# Altium schematic sheet ruler.SchDoc
size C
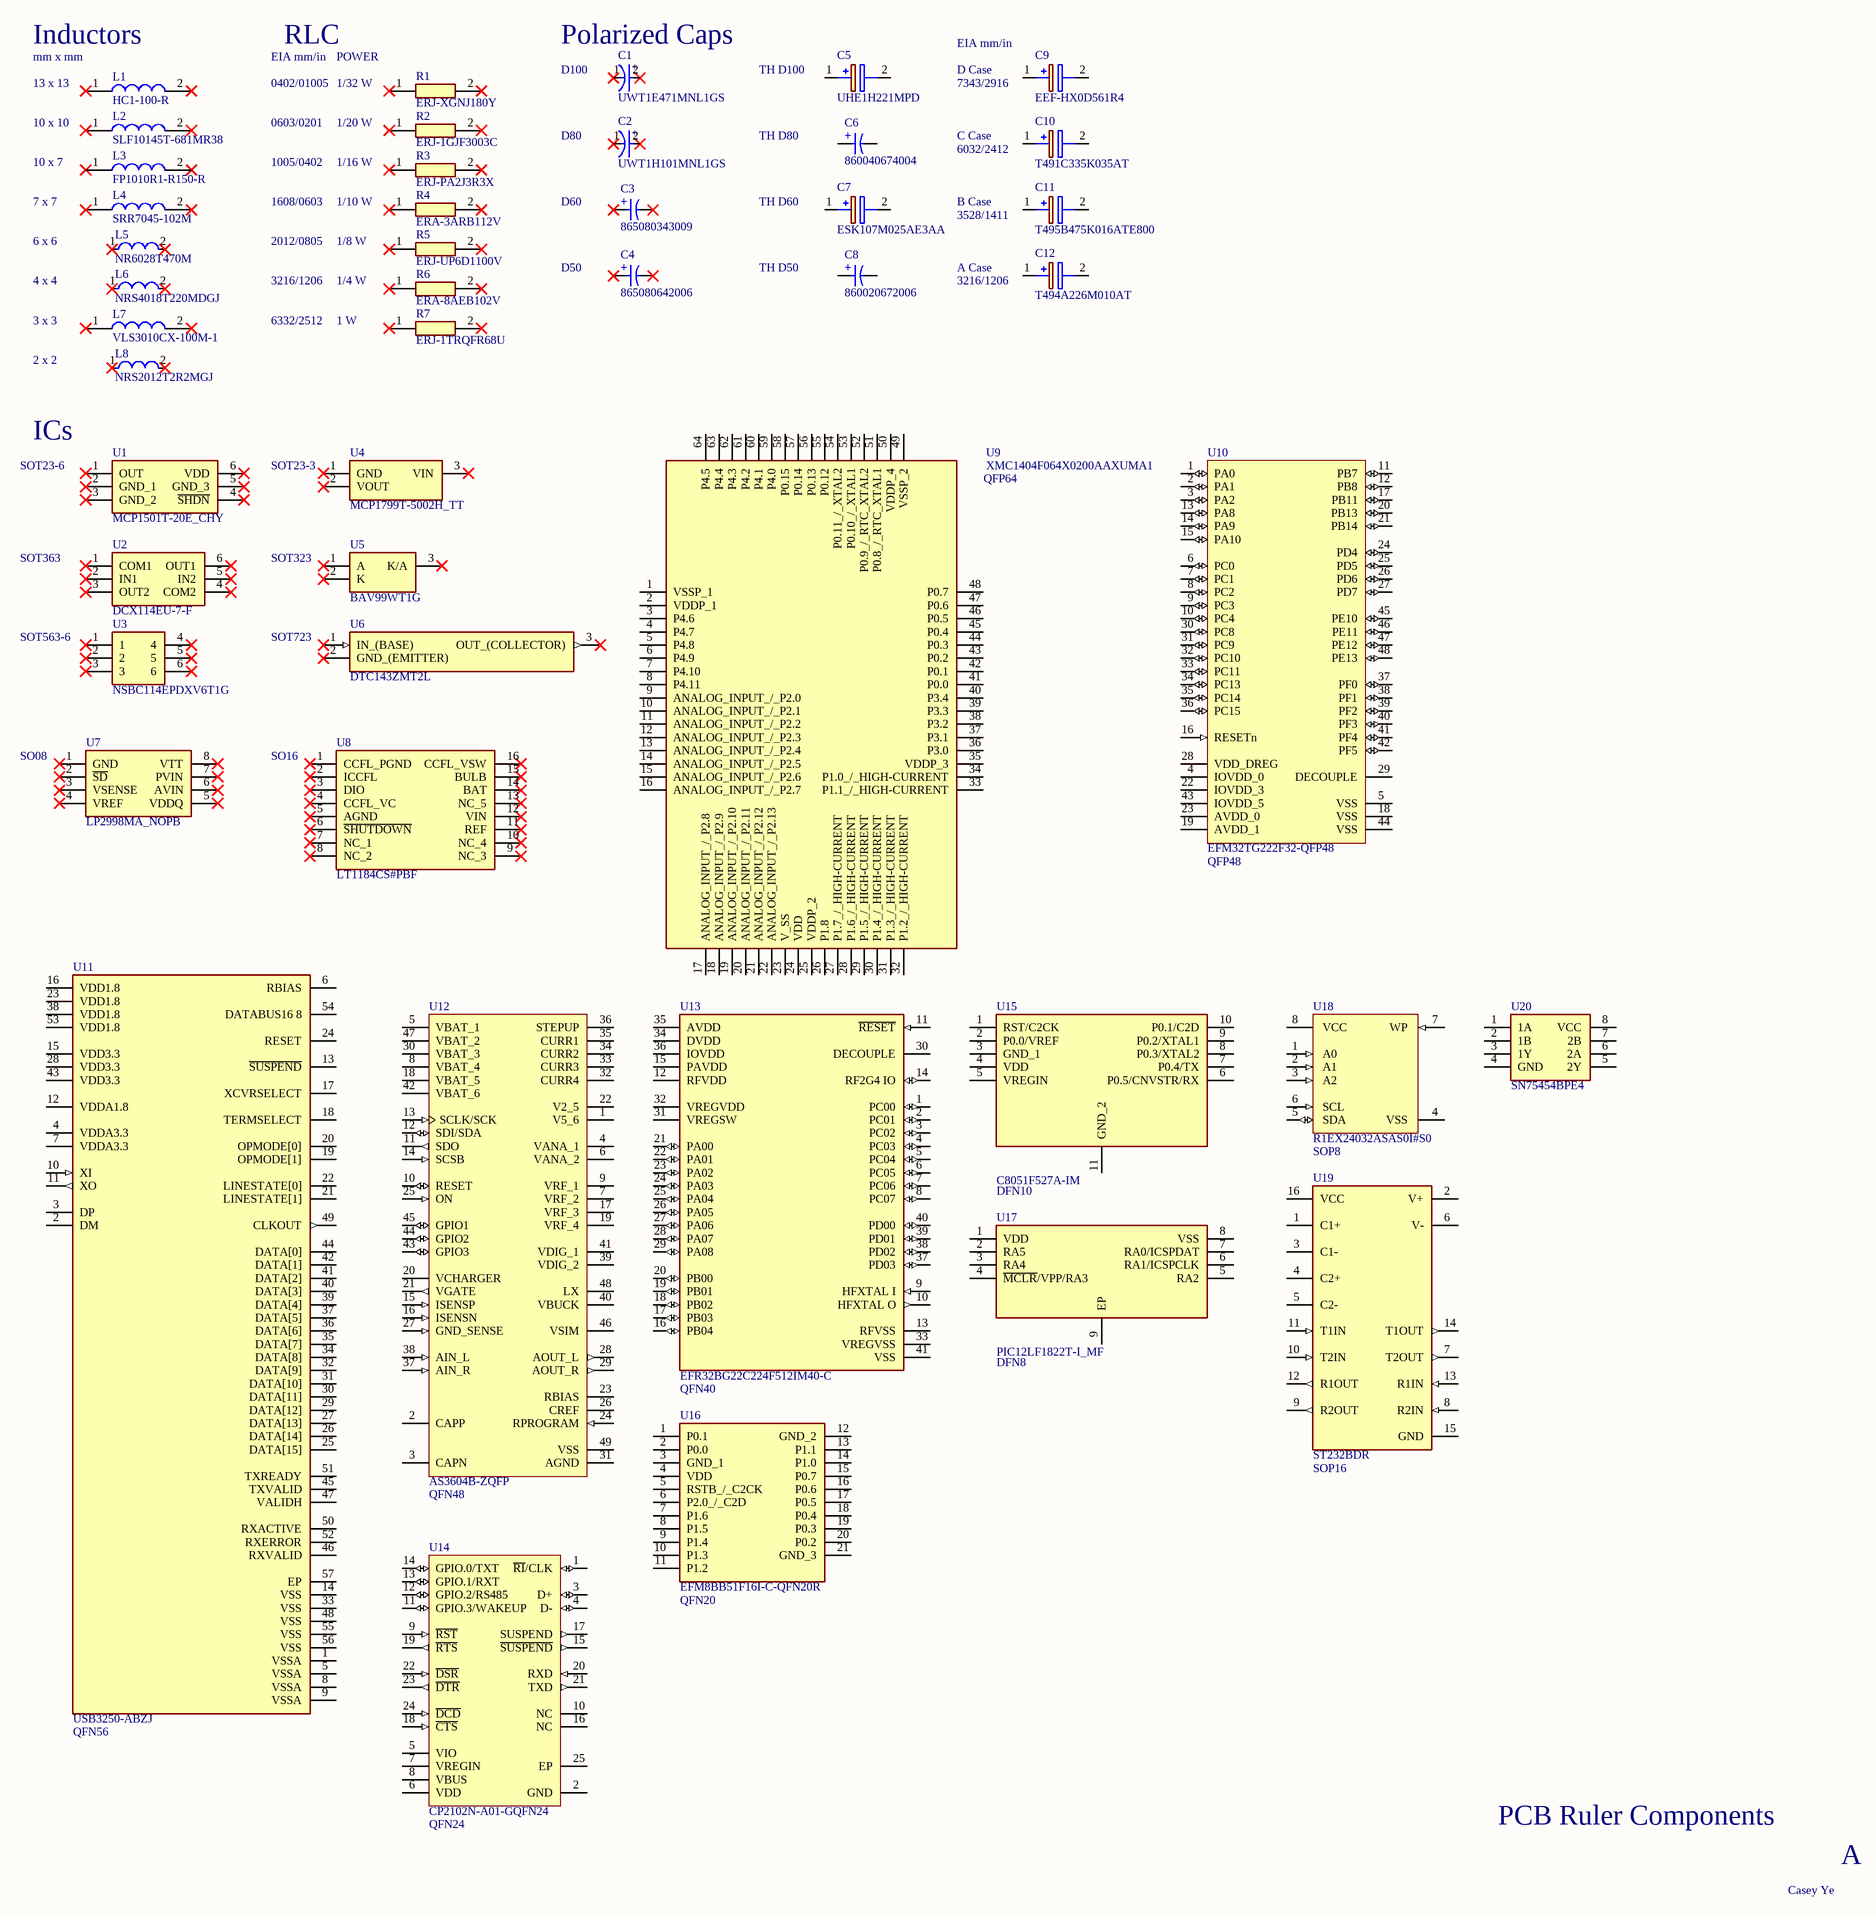
[diagram p0: ruler.SchDoc]

## Parts
C1  UWT1E471MNL1GS  [FP-UWT1E471MNL1GS-MFG]
C2  UWT1H101MNL1GS  [FP-UWT1H101MNL1GS-MFG]
C3  865080343009  [WCAP-ASLI_D6.3H5.5]
C4  865080642006  [WCAP-ASLI_D5H5.5]
C5  UHE1H221MPD  [CAPPRD500W60D1025H1750]
C6  860040674004  [WCAP-ATUL_D8H11.5]
C7  ESK107M025AE3AA  [CAPPRD250W50D630H1250]
C8  860020672006  [WCAP-ATG5_D5H11]
C9  EEF-HX0D561R4  [HX_Series]
C10  T491C335K035AT  [T491C]
C11  T495B475K016ATE800  [T495B]
C12  T494A226M010AT  [T494A]
L1  HC1-100-R  [HC1100R]
L2  SLF10145T-681MR38  [SLF10145]
L3  FP1010R1-R150-R  [FP1010R1R150R]
L4  SRR7045-102M  [SRR7045102M]
L5  NR6028T470M  [FP-NR6028-MFG]
L6  NRS4018T220MDGJ  [FP-NR4018-MFG]
L7  VLS3010CX-100M-1  [VLS3010]
L8  NRS2012T2R2MGJ  [FP-NRS2012-MFG]
R1  ERJ-XGNJ180Y  [ERJXG_(01005)]
R2  ERJ-1GJF3003C  [ERJ1GJJ2R4C]
R3  ERJ-PA2J3R3X  [RESC1005X40N]
R4  ERA-3ARB112V  [ERA3AEB101V]
R5  ERJ-UP6D1100V  [ERJUP6]
R6  ERA-8AEB102V  [RESC3216X70N]
R7  ERJ-1TRQFR68U  [ER1TR_(2512)]
U1  MCP1501T-20E_CHY  [SOT95P280X145-6N]
U2  DCX114EU-7-F  [SOT65P210X110-6N]
U3  NSBC114EPDXV6T1G  [SOTFL50P160X60-6N]
U4  MCP1799T-5002H_TT  [SOT95P237X112-3N]
U5  BAV99WT1G  [SOT65P220X100-3N]
U6  DTC143ZMT2L  [SOT40P120X55-3N]
U7  LP2998MA_NOPB  [SOIC127P600X175-8N]
U8  LT1184CS#PBF  [SOIC127P599X175-16N]
U9  XMC1404F064X0200AAXUMA1  [QFP50P1200X1200X160-64N]
U10  EFM32TG222F32-QFP48  [ENMR-TQFP48_M]
U11  USB3250-ABZJ  [FP-56QFN-4304-8x8B-MFG]
U12  AS3604B-ZQFP  [AMS-QFN-48-6000X6000DE-4300X4300TP_L]
U13  EFR32BG22C224F512IM40-C  [FP-EFR32BG22C224F512IM40-MFG]
U14  CP2102N-A01-GQFN24  [SLAB-QFN-24-2550x2550TP_A_V]
U15  C8051F527A-IM  [SON50P300X300X100-11N-D]
U16  EFM8BB51F16I-C-QFN20R  [EFM8BB51F16ICQFN20R]
U17  PIC12LF1822T-I_MF  [SON65P300X300X100-9N-D]
U18  R1EX24032ASAS0I#S0  [SOP127P600X173-8_PRSP0008DF-B_N]
U19  ST232BDR  [FP-SO-16-0016020D-IPC_C]
U20  SN75454BPE4  [DIP794W53P254L959H508Q8N]

## Nets

Not connected (* = marked no-connect by the designer): C1 1(C)* 2(A)*; C2 1(C)* 2(A)*; C3 1(P)* 2(N)*; C4 1(P)* 2(N)*; C5 1(+) 2(-); C6 1(P) 2(N); C7 1(+) 2(-); C8 1(P) 2(N); C9 1(+) 2(-); C10 1(+) 2(-); C11 1(+) 2(-); C12 1(+) 2(-); L1 1* 2*; L2 1* 2*; L3 1* 2*; L4 1* 2*; L5 1* 2*; L6 1* 2*; L7 1* 2*; L8 1* 2*; R1 1* 2*; R2 1* 2*; R3 1* 2*; R4 1* 2*; R5 1* 2*; R6 1* 2*; R7 1* 2*; U1 1(OUT)* 2(GND_1)* 3(GND_2)* 4(~{SHDN})* 5(GND_3)* 6(VDD)*; U2 1(COM1)* 2(IN1)* 3(OUT2)* 4(COM2)* 5(IN2)* 6(OUT1)*; U3 1* 2* 3* 4* 5* 6*; U4 1(GND)* 2(VOUT)* 3(VIN)*; U5 1(A)* 2(K)* 3(K/A)*; U6 1(IN_(BASE))* 2(GND_(EMITTER))* 3(OUT_(COLLECTOR))*; U7 1(GND)* 2(~{SD})* 3(VSENSE)* 4(VREF)* 5(VDDQ)* 6(AVIN)* 7(PVIN)* 8(VTT)*; U8 1(CCFL_PGND)* 2(ICCFL)* 3(DIO)* 4(CCFL_VC)* 5(AGND)* 6(~{SHUTDOWN})* 7(NC_1)* 8(NC_2)* 9(NC_3)* 10(NC_4)* 11(REF)* 12(VIN)* 13(NC_5)* 14(BAT)* 15(BULB)* 16(CCFL_VSW)*; U9 1(VSSP_1) 2(VDDP_1) 3(P4.6) 4(P4.7) 5(P4.8) 6(P4.9) 7(P4.10) 8(P4.11) 9(ANALOG_INPUT_/_P2.0) 10(ANALOG_INPUT_/_P2.1) 11(ANALOG_INPUT_/_P2.2) 12(ANALOG_INPUT_/_P2.3) 13(ANALOG_INPUT_/_P2.4) 14(ANALOG_INPUT_/_P2.5) 15(ANALOG_INPUT_/_P2.6) 16(ANALOG_INPUT_/_P2.7) 17(ANALOG_INPUT_/_P2.8) 18(ANALOG_INPUT_/_P2.9) 19(ANALOG_INPUT_/_P2.10) 20(ANALOG_INPUT_/_P2.11) 21(ANALOG_INPUT_/_P2.12) 22(ANALOG_INPUT_/_P2.13) 23(V_SS) 24(VDD) 25(VDDP_2) 26(P1.8) 27(P1.7_/_HIGH-CURRENT) 28(P1.6_/_HIGH-CURRENT) 29(P1.5_/_HIGH-CURRENT) 30(P1.4_/_HIGH-CURRENT) 31(P1.3_/_HIGH-CURRENT) 32(P1.2_/_HIGH-CURRENT) 33(P1.1_/_HIGH-CURRENT) 34(P1.0_/_HIGH-CURRENT) 35(VDDP_3) 36(P3.0) 37(P3.1) 38(P3.2) 39(P3.3) 40(P3.4) 41(P0.0) 42(P0.1) 43(P0.2) 44(P0.3) 45(P0.4) 46(P0.5) 47(P0.6) 48(P0.7) 49(VSSP_2) 50(VDDP_4) 51(P0.8_/_RTC_XTAL1) 52(P0.9_/_RTC_XTAL2) 53(P0.10_/_XTAL1) 54(P0.11_/_XTAL2) 55(P0.12) 56(P0.13) 57(P0.14) 58(P0.15) 59(P4.0) 60(P4.1) 61(P4.2) 62(P4.3) 63(P4.4) 64(P4.5); U10 1(PA0) 2(PA1) 3(PA2) 4(IOVDD_0) 5(VSS) 6(PC0) 7(PC1) 8(PC2) 9(PC3) 10(PC4) 11(PB7) 12(PB8) 13(PA8) 14(PA9) 15(PA10) 16(RESETn) 17(PB11) 18(VSS) 19(AVDD_1) 20(PB13) 21(PB14) 22(IOVDD_3) 23(AVDD_0) 24(PD4) 25(PD5) 26(PD6) 27(PD7) 28(VDD_DREG) 29(DECOUPLE) 30(PC8) 31(PC9) 32(PC10) 33(PC11) 34(PC13) 35(PC14) 36(PC15) 37(PF0) 38(PF1) 39(PF2) 40(PF3) 41(PF4) 42(PF5) 43(IOVDD_5) 44(VSS) 45(PE10) 46(PE11) 47(PE12) 48(PE13); U11 1(VSSA) 2(DM) 3(DP) 4(VDDA3.3) 5(VSSA) 6(RBIAS) 7(VDDA3.3) 8(VSSA) 9(VSSA) 10(XI) 11(XO) 12(VDDA1.8) 13(~{SUSPEND}) 14(VSS) 15(VDD3.3) 16(VDD1.8) 17(XCVRSELECT) 18(TERMSELECT) 19(OPMODE[1]) 20(OPMODE[0]) 21(LINESTATE[1]) 22(LINESTATE[0]) 23(VDD1.8) 24(RESET) 25(DATA[15]) 26(DATA[14]) 27(DATA[13]) 28(VDD3.3) 29(DATA[12]) 30(DATA[11]) 31(DATA[10]) 32(DATA[9]) 33(VSS) 34(DATA[8]) 35(DATA[7]) 36(DATA[6]) 37(DATA[5]) 38(VDD1.8) 39(DATA[4]) 40(DATA[3]) 41(DATA[2]) 42(DATA[1]) 43(VDD3.3) 44(DATA[0]) 45(TXVALID) 46(RXVALID) 47(VALIDH) 48(VSS) 49(CLKOUT) 50(RXACTIVE) 51(TXREADY) 52(RXERROR) 53(VDD1.8) 54(DATABUS16_8) 55(VSS) 56(VSS) 57(EP); U12 1(V5_6) 2(CAPP) 3(CAPN) 4(VANA_1) 5(VBAT_1) 6(VANA_2) 7(VRF_2) 8(VBAT_4) 9(VRF_1) 10(RESET) 11(SDO) 12(SDI/SDA) 13(SCLK/SCK) 14(SCSB) 15(ISENSP) 16(ISENSN) 17(VRF_3) 18(VBAT_5) 19(VRF_4) 20(VCHARGER) 21(VGATE) 22(V2_5) 23(RBIAS) 24(RPROGRAM) 25(ON) 26(CREF) 27(GND_SENSE) 28(AOUT_L) 29(AOUT_R) 30(VBAT_3) 31(AGND) 32(CURR4) 33(CURR3) 34(CURR2) 35(CURR1) 36(STEPUP) 37(AIN_R) 38(AIN_L) 39(VDIG_2) 40(VBUCK) 41(VDIG_1) 42(VBAT_6) 43(GPIO3) 44(GPIO2) 45(GPIO1) 46(VSIM) 47(VBAT_2) 48(LX) 49(VSS); U13 1(PC00) 2(PC01) 3(PC02) 4(PC03) 5(PC04) 6(PC05) 7(PC06) 8(PC07) 9(HFXTAL_I) 10(HFXTAL_O) 11(~{RESET}) 12(RFVDD) 13(RFVSS) 14(RF2G4_IO) 15(PAVDD) 16(PB04) 17(PB03) 18(PB02) 19(PB01) 20(PB00) 21(PA00) 22(PA01) 23(PA02) 24(PA03) 25(PA04) 26(PA05) 27(PA06) 28(PA07) 29(PA08) 30(DECOUPLE) 31(VREGSW) 32(VREGVDD) 33(VREGVSS) 34(DVDD) 35(AVDD) 36(IOVDD) 37(PD03) 38(PD02) 39(PD01) 40(PD00) 41(VSS); U14 1(~{RI}/CLK) 2(GND) 3(D+) 4(D-) 5(VIO) 6(VDD) 7(VREGIN) 8(VBUS) 9(~{RST}) 10(NC) 11(GPIO.3/WAKEUP) 12(GPIO.2/RS485) 13(GPIO.1/RXT) 14(GPIO.0/TXT) 15(~{SUSPEND}) 16(NC) 17(SUSPEND) 18(~{CTS}) 19(~{RTS}) 20(RXD) 21(TXD) 22(~{DSR}) 23(~{DTR}) 24(~{DCD}) 25(EP); U15 1(RST/C2CK) 2(P0.0/VREF) 3(GND_1) 4(VDD) 5(VREGIN) 6(P0.5/CNVSTR/RX) 7(P0.4/TX) 8(P0.3/XTAL2) 9(P0.2/XTAL1) 10(P0.1/C2D) 11(GND_2); U16 1(P0.1) 2(P0.0) 3(GND_1) 4(VDD) 5(RSTB_/_C2CK) 6(P2.0_/_C2D) 7(P1.6) 8(P1.5) 9(P1.4) 10(P1.3) 11(P1.2) 12(GND_2) 13(P1.1) 14(P1.0) 15(P0.7) 16(P0.6) 17(P0.5) 18(P0.4) 19(P0.3) 20(P0.2) 21(GND_3); U17 1(VDD) 2(RA5) 3(RA4) 4(~{MCLR}/VPP/RA3) 5(RA2) 6(RA1/ICSPCLK) 7(RA0/ICSPDAT) 8(VSS) 9(EP); U18 1(A0) 2(A1) 3(A2) 4(VSS) 5(SDA) 6(SCL) 7(WP) 8(VCC); U19 1(C1+) 2(V+) 3(C1-) 4(C2+) 5(C2-) 6(V-) 7(T2OUT) 8(R2IN) 9(R2OUT) 10(T2IN) 11(T1IN) 12(R1OUT) 13(R1IN) 14(T1OUT) 15(GND) 16(VCC); U20 1(1A) 2(1B) 3(1Y) 4(GND) 5(2Y) 6(2A) 7(2B) 8(VCC)

## Notes on the sheet
- (near L1) Inductors
- (near L1) mm x mm
- 13 x 13
- EIA mm/in
- 0402/01005
- RLC
- POWER
- 1/32 W
- (near C1) Polarized Caps
- (near C1) D100
- (near C5) TH D100
- (near C9) 7343/2916
- (near C9) EIA mm/in
- (near C9) D Case
- 10 x 10
- 10 x 7
- 0603/0201
- 1005/0402
- 1/20 W
- 1/16 W
- D80
- TH D80
- (near C10) 6032/2412
- C Case
- 7 x 7
- 1608/0603
- 1/10 W
- D60
- (near C7) TH D60
- (near C11) 3528/1411
- B Case
- 6 x 6
- 4 x 4
- 2012/0805
- 3216/1206
- 1/8 W
- 1/4 W
- D50
- TH D50
- (near C12) 3216/1206
- A Case
- 3 x 3
- 2 x 2
- 6332/2512
- 1 W
- (near U1) SOT23-6
- ICs
- SOT23-3
- (near U9) QFP64
- SOT363
- SOT323
- SOT563-6
- SOT723
- (near U7) SO08
- (near U8) SO16
- (near U10) QFP48
- SOP8
- DFN10
- QFN40
- (near U17) DFN8
- (near U19) SOP16
- (near U12) QFN48
- (near U16) QFN20
- (near U11) QFN56
- (near U14) QFN24
- PCB Ruler Components
- A
- Casey Ye
- (in symbol CMP-2000-07373-2) +
- (in symbol CMP-03913-53914229-1) +
- (in symbol CMP-03913-53914310-1) +
- (in symbol CMP-03913-53914574-1) +
- (in symbol CMP-03913-53914615-1) +
- (in symbol CMP-12462-000037-1) +

## Library data of the parts
C1 = CMP-12462-000037-1: CAP ALUM 470UF 20% 25V SMD; Leakage Current: 3uA; Dielectric Material: Aluminium; Ripple Current: 300mA; Life (Hours): 1000Hour; Lead Diameter: 1.1mm; Dissipation Factor: 0.16%; Min Operating Temperature: -55°C; Height - Seated (Max): 0.394inch; REACH SVHC: No SVHC; Radiation Hardening: No; Capacitance: 470uF; Lead Free: Lead Free; Voltage: 25V; Length: 10mm; Mount: Surface Mount; Package Quantity: 500; Height: 10mm; Lead Pitch: 4.5mm; Series: WT; Max Operating Temperature: 105°C; Number of Pins: 2; Voltage Rating: 25V; RoHS Compliant: Yes; Construction: Cylindrical; Voltage Rating (DC): 25V; Packaging: Tape and Reel; Ripple Current (AC): 300mA; Tolerance: 20%; Termination: SMD/SMT; Case/Package: Radial; Diameter: 10mm
C2 = CMP-2000-07373-2: CAP ALUM 100UF 20% 50V SMD; Leakage Current: 3uA; Ripple Current: 140mA; Life (Hours): 1000Hour; Dissipation Factor: 0.14%; Dielectric Material: Aluminium; Termination: SMD/SMT; Tolerance: 20%; Package Quantity: 500; Capacitance: 100uF; Height: 10mm; REACH SVHC: No SVHC; Case/Package: Radial; Series: WT; Diameter: 8mm; Voltage Rating: 50V; Construction: Cylindrical; Length: 10mm; Min Operating Temperature: -55°C; Max Operating Temperature: 105°C; Voltage Rating (DC): 50V; Packaging: Tape and Reel; Voltage: 50V; Mount: Surface Mount; Ripple Current (AC): 140mA; Radiation Hardening: No; Number of Pins: 2; Lead Free: Lead Free; Height - Seated (Max): 0.413inch; RoHS Compliant: Yes
C3 = CMP-03913-53914574-1: 865080343009 WCAP-ASLI Aluminum Electrolytic Capacitors; Capacitance: 100µF; Polarity: Polar; Voltage Rating: 16V; Life (Hours): 2000hours; Tolerance: 20%; Impedance: 520mΩ; Ripple Current: 255mA; ESR (Equivalent Series Resistance): 399.422mΩ; Leakage Current: 16µA; Insulation Resistance: 1MΩ; Height: 5.5mm; NexarPartId: 53914574; Length: 5.5mm; Max Operating Temperature: 105°C; Min Operating Temperature: -55°C; Case/Package: Radial; RoHS: Compliant; Mount: Surface Mount; Lead Free: Lead Free; Voltage Rating (DC): 16V; Packaging: Tape & Reel (TR); Ripple Current (AC): 255mA; Diameter: 6.3mm; Height - Seated (Max): 5.5118mm; Width: 6.6mm; REACH SVHC: Unknown
C4 = CMP-03913-53914615-1: 865080642006 WCAP-ASLI Aluminum Electrolytic Capacitors; Tolerance: 20%; Ripple Current (AC): 95mA; Polarity: Polar; Leakage Current: 5µA; Voltage Rating: 50V; ESR (Equivalent Series Resistance): 1.63932Ω; Capacitance: 10µF; Impedance: 2.8Ω; Insulation Resistance: 10MΩ; Life (Hours): 2000hours; Max Operating Temperature: 105°C; Ripple Current: 95mA; Case/Package: Radial; REACH SVHC: Unknown; Mount: Surface Mount; Width: 5.3mm; Diameter: 5mm; Min Operating Temperature: -55°C; Height: 5.5mm; Height - Seated (Max): 5.5118mm; Packaging: Cut Tape (CT); Voltage Rating (DC): 50V; Length: 5.5mm; RoHS: Compliant; NexarPartId: 53914615
C5 = UHE1H221MPD: Capacitor Polarised; Manufacturer_Name: Nichicon; Datasheet Link: http://nichicon-us.com/english/products/pdfs/e-uhe.pdf; Height: 17.5mm; Manufacturer_Part_Number: UHE1H221MPD; Mouser Part Number: 647-UHE1H221MPD; Mouser Price/Stock: https://www.mouser.co.uk/ProductDetail/Nichicon/UHE1H221MPD?qs=HkjdomHsiM8vBbPWt47Ogg%3D%3D; Arrow Part Number: UHE1H221MPD; Arrow Price/Stock: https://www.arrow.com/en/products/uhe1h221mpd/nichicon?utm_currency=USD&region=nac
C6 = CMP-03913-53914310-1: 860040674004 WCAP-ATUL Aluminum Electrolytic Capacitors; Impedance: 160mΩ; Tolerance: 20%; Capacitance: 100µF; Voltage Rating: 50V; Polarity: Polar; Ripple Current: 680mA; Pitch: 3.5mm; Life (Hours): 7000hours; Leakage Current: 50µA; Height - Seated (Max): 13.0048mm; Height: 11.5mm; Mount: Through Hole; Max Operating Temperature: 105°C; RoHS: Compliant; Diameter: 8mm; Lead Pitch: 3.5052mm; Packaging: Tape & Box (TB); NexarPartId: 53914310; Voltage Rating (DC): 50V; Length: 11.5mm; REACH SVHC: Unknown; Case/Package: Radial; Min Operating Temperature: -40°C
C7 = ESK107M025AE3AA: Capacitor Polarised; Manufacturer_Name: KEMET; Datasheet Link: https://content.kemet.com/datasheets/KEM_A4004_ESK.pdf; Height: 12.5mm; Manufacturer_Part_Number: ESK107M025AE3AA; Mouser Part Number: 80-ESK107M025AE3AA; Mouser Price/Stock: https://www.mouser.co.uk/ProductDetail/KEMET/ESK107M025AE3AA?qs=907G%252Bm7SbTsCEGMWVdzeXA%3D%3D; Arrow Part Number: ESK107M025AE3AA; Arrow Price/Stock: https://www.arrow.com/en/products/esk107m025ae3aa/kemet-corporation
C8 = CMP-03913-53914229-1: 860020672006 WCAP-ATG5 Aluminum Electrolytic Capacitors; Tolerance: 20%; Capacitance: 2.2µF; Voltage Rating: 50V; Leakage Current: 3µA; Life (Hours): 2000hours; Pitch: 2mm; Ripple Current: 20mA; Polarity: Polar; Min Operating Temperature: -40°C; Max Operating Temperature: 105°C; NexarPartId: 53914229; Case/Package: Radial; Height: 11mm; Packaging: Tape & Box (TB); Height - Seated (Max): 12.4968mm; Lead Pitch: 2.0066mm; Mount: Through Hole; Length: 11mm; RoHS: Compliant; Diameter: 5mm; REACH SVHC: Unknown; Voltage Rating (DC): 50V
C9 = EEF-HX0D561R4: Capacitor Polarised; Manufacturer_Name: Panasonic; Datasheet Link: https://industrial.panasonic.com/cdbs/www-data/pdf/ABE0000/ABE0000C90.pdf; Height: 2mm; Manufacturer_Part_Number: EEF-HX0D561R4; Mouser Part Number: 667-EEF-HX0D561R4; Mouser Price/Stock: https://www.mouser.co.uk/ProductDetail/Panasonic/EEF-HX0D561R4?qs=XtgyILOJlWPLbP5rg%2FixBQ%3D%3D; Arrow Part Number: EEF-HX0D561R4; Arrow Price/Stock: https://www.arrow.com/en/products/eef-hx0d561r4/panasonic?region=nac
C10 = T491C335K035AT: Capacitor Polarised; Manufacturer_Name: KEMET; Datasheet Link: https://content.kemet.com/datasheets/KEM_T2005_T491.pdf; Height: 2.8mm; Manufacturer_Part_Number: T491C335K035AT; Mouser Part Number: 80-T491C335K035; Mouser Price/Stock: https://www.mouser.co.uk/ProductDetail/KEMET/T491C335K035AT?qs=qfhfvpM3tghah%2FdvWnQejA%3D%3D; Arrow Part Number: T491C335K035AT; Arrow Price/Stock: https://www.arrow.com/en/products/t491c335k035at/kemet-corporation?region=europe
C11 = T495B475K016ATE800: Capacitor Polarised; Manufacturer_Name: KEMET; Datasheet Link: https://content.kemet.com/datasheets/KEM_T2009_T495.pdf; Height: 2.1mm; Manufacturer_Part_Number: T495B475K016ATE800; Mouser Part Number: 80-T495B475K16ATE800; Mouser Price/Stock: https://www.mouser.co.uk/ProductDetail/KEMET/T495B475K016ATE800?qs=dnvuLCnOKpthNwmIUPliMw%3D%3D; Arrow Part Number: T495B475K016ATE800; Arrow Price/Stock: https://www.arrow.com/en/products/t495b475k016ate800/kemet-corporation
C12 = T494A226M010AT: Capacitor Polarised; Manufacturer_Name: KEMET; Datasheet Link: https://content.kemet.com/datasheets/KEM_T2008_T494.pdf; Height: 1.8mm; Manufacturer_Part_Number: T494A226M010AT; Mouser Part Number: 80-T494A226M010; Mouser Price/Stock: https://www.mouser.co.uk/ProductDetail/KEMET/T494A226M010AT?qs=Ql1pWNiwXgajRWlSWe6JnA%3D%3D
L1 = HC1-100-R: Inductor; Manufacturer_Name: Eaton; Datasheet Link: https://www.eaton.com/content/dam/eaton/products/electronic-components/resources/data-sheet/eaton-hc1-high-current-inductor-data-sheet.pdf; Height: 10mm; Manufacturer_Part_Number: HC1-100-R; Mouser Part Number: 704-HC1-100-R; Mouser Price/Stock: https://www.mouser.co.uk/ProductDetail/Eaton-Electronics/HC1-100-R?qs=yzwxPInThYSDEsv3O8Y5%252Bg%3D%3D; Arrow Part Number: HC1-100-R; Arrow Price/Stock: https://www.arrow.com/en/products/hc1-100-r/eaton?region=nac
L2 = SLF10145T-681MR38: Inductor; Manufacturer_Name: TDK; Manufacturer_Part_Number: SLF10145T-681MR38; Mouser Part Number: 810-SLF10145-681MR38; Mouser Price/Stock: https://www.mouser.co.uk/ProductDetail/TDK/SLF10145T-681MR38?qs=stv2FWaTEl%252BNZxZNDG6UIw%3D%3D
L3 = FP1010R1-R150-R: Inductor; Manufacturer_Name: Eaton; Datasheet Link: https://www.eaton.com/content/dam/eaton/products/electronic-components/resources/data-sheet/eaton-fp1010r-high-current-power-inductors-data-sheet.pdf; Height: 10mm; Manufacturer_Part_Number: FP1010R1-R150-R; Mouser Part Number: 504-FP1010R1-R150-R; Mouser Price/Stock: https://www.mouser.co.uk/ProductDetail/Bussmann-Eaton/FP1010R1-R150-R?qs=BZBei1rCqCC7kcbKCasqag%3D%3D
L4 = SRR7045-102M: Inductor; Manufacturer_Name: Bourns; Datasheet Link: https://www.bourns.com/pdfs/SRR7045.pdf; Height: 4.8mm; Manufacturer_Part_Number: SRR7045-102M; Mouser Part Number: 652-SRR7045-102M; Mouser Price/Stock: https://www.mouser.co.uk/ProductDetail/Bourns/SRR7045-102M?qs=y9m3SKnhpLNQW0CEuyCgJw%3D%3D; Arrow Part Number: SRR7045-102M; Arrow Price/Stock: https://www.arrow.com/en/products/srr7045-102m/bourns?region=nac
L5 = CMP-14484-001222-1: SMD Power Inductors 47uH ±20% 0.92A 0.39Ω; Current Rating: 920mA; Test Frequency: 100kHz; Core Material: Ferrite; Self Resonant Frequency: 8MHz; Shielding: Shielded; DC Resistance (DCR): 390mR; Saturation Current: 950mA; Termination: SMD/SMT; Package Quantity: 2000; RoHS Compliant: Yes; Inductance: 47uH; Halogen Free: Halogen Free; Length: 0.236inch; Series: NR; Tolerance: 20%; Width: 0.236inch; Height - Seated (Max): 0.11inch; Number of Pins: 2; Mount: Surface Mount; Min Operating Temperature: -25°C; RMS Current (Irms): 920mA; Packaging: Tape and Reel; Resistor Type: Wirewound; Case/Package: 2424; Inductance Tolerance: 20%; Max Operating Temperature: 120°C; Max DC Current: 920mA; Height: 2.8mm
L6 = CMP-14484-001399-1: SMD Power Inductors 22uH ±20% 0.72A 0.348Ω; Current Rating: 720mA; DC Resistance (DCR): 348mR; Saturation Current: 900mA; Core Material: Ferrite; Self Resonant Frequency: 15MHz; Shielding: Shielded; Test Frequency: 100kHz; Packaging: Tape and Reel; RoHS Compliant: Yes; Lead Pitch: 2.8mm; Number of Pins: 2; Min Operating Temperature: -25°C; Termination: SMD/SMT; Height - Seated (Max): 0.071inch; Max Operating Temperature: 125°C; Lead Free: Lead Free; Length: 4mm; REACH SVHC: No SVHC; Width: 0.157inch; RMS Current (Irms): 720mA; Radiation Hardening: No; Resistor Type: Wirewound; Inductance: 22uH; Tolerance: 20%; Depth: 4.2mm; Max DC Current: 720mA; Mount: Surface Mount; Series: NRS; Inductance Tolerance: 20%; Height: 1.8mm; Package Quantity: 3500; Case/Package: 4018; Halogen Free: Halogen Free
L7 = VLS3010CX-100M-1: Inductor; Manufacturer_Name: TDK; Datasheet Link: https://product.tdk.com/system/files/dam/doc/product/inductor/inductor/smd/catalog/inductor_commercial_power_vls3010cx-1_en.pdf; Manufacturer_Part_Number: VLS3010CX-100M-1; Mouser Part Number: 810-VLS3010CX100M1; Mouser Price/Stock: https://www.mouser.co.uk/ProductDetail/TDK/VLS3010CX-100M-1?qs=sPbYRqrBIVmMLVtWqVWK7g%3D%3D; Arrow Part Number: VLS3010CX-100M-1; Arrow Price/Stock: https://www.arrow.com/en/products/vls3010cx-100m-1/tdk?utm_currency=USD&region=nac
L8 = CMP-14484-000742-1: Shielded Wirewound Inductor 2.2uH 20% 1.5A 0.1284Ω SMD; Saturation Current: 1.35A; DC Resistance (DCR): 107mR; Core Material: Ferrite; Test Frequency: 100kHz; Current Rating: 1.37A; Package Quantity: 2500; RoHS Compliant: Yes; Tolerance: 20%; Width: 0.079inch; Min Operating Temperature: -25°C; Mount: Surface Mount; Packaging: Tape and Reel; Length: 0.079inch; Max Operating Temperature: 120°C; Height - Seated (Max): 0.047inch; Termination: SMD/SMT; Shielding: Shielded; Height: 1.2mm; Inductance: 2.2uH; Max DC Current: 1.35A; Case/Package: Nonstandard; Halogen Free: Halogen Free
R1 = ERJ-XGNJ180Y: Resistor; Manufacturer_Name: Panasonic; Datasheet Link: https://industrial.panasonic.com/cdbs/www-data/pdf/RDA0000/AOA0000C301.pdf; Height: 0.15mm; Manufacturer_Part_Number: ERJ-XGNJ180Y; Mouser Part Number: 667-ERJ-XGNJ180Y; Mouser Price/Stock: https://www.mouser.co.uk/ProductDetail/Panasonic/ERJ-XGNJ180Y?qs=9gtMhpKs0nFk3pYNjHEbcQ%3D%3D
R2 = ERJ-1GJF3003C: Resistor; Manufacturer_Name: Panasonic; Datasheet Link: https://industrial.panasonic.com/cdbs/www-data/pdf/RDA0000/AOA0000C304.pdf; Height: 0.26mm; Manufacturer_Part_Number: ERJ-1GJF3003C; Mouser Part Number: 667-ERJ-1GJF3003C; Mouser Price/Stock: https://www.mouser.co.uk/ProductDetail/Panasonic/ERJ-1GJF3003C?qs=OcgtsXO%252B3gtYOv79pS6CzQ%3D%3D
R3 = ERJ-PA2J3R3X: Resistor; Manufacturer_Name: Panasonic; Datasheet Link: https://industrial.panasonic.com/cdbs/www-data/pdf/RDO0000/AOA0000C331.pdf; Height: 0.4mm; Manufacturer_Part_Number: ERJ-PA2J3R3X
R4 = ERA-3ARB112V: Resistor; Manufacturer_Name: Panasonic; Datasheet Link: https://industrial.panasonic.com/cdbs/www-data/pdf/RDM0000/AOA0000C307.pdf; Height: 0.55mm; Manufacturer_Part_Number: ERA-3ARB112V; Mouser Part Number: 667-ERA-3ARB112V; Mouser Price/Stock: https://www.mouser.com/Search/Refine.aspx?Keyword=667-ERA-3ARB112V
R5 = ERJ-UP6D1100V: Resistor; Manufacturer_Name: Panasonic; Datasheet Link: https://industrial.panasonic.com/cdbs/www-data/pdf/RDP0000/AOA0000C337.pdf; Height: 0.7mm; Manufacturer_Part_Number: ERJ-UP6D1100V; Mouser Part Number: 667-ERJ-UP6D1100V; Mouser Price/Stock: https://www.mouser.co.uk/ProductDetail/Panasonic/ERJ-UP6D1100V?qs=ZcfC38r4PovnndfGA3dQ%2FQ%3D%3D; Arrow Part Number: ERJ-UP6D1100V; Arrow Price/Stock: https://www.arrow.com/en/products/erj-up6d1100v/panasonic?region=nac
R6 = ERA-8AEB102V: Resistor; Manufacturer_Name: Panasonic; Datasheet Link: https://industrial.panasonic.com/cdbs/www-data/pdf/RDM0000/AOA0000C307.pdf; Height: 0.7mm; Manufacturer_Part_Number: ERA-8AEB102V; Mouser Part Number: 667-ERA-8AEB102V; Mouser Price/Stock: https://www.mouser.co.uk/ProductDetail/Panasonic/ERA-8AEB102V?qs=Ojoo2rCVP9R3RwZw0XjknA%3D%3D; Arrow Part Number: ERA-8AEB102V; Arrow Price/Stock: https://www.arrow.com/en/products/era-8aeb102v/panasonic?utm_currency=USD&region=nac
R7 = ERJ-1TRQFR68U: Resistor; Manufacturer_Name: Panasonic; Datasheet Link: http://industrial.panasonic.com/cdbs/www-data/pdf/RDN0000/AOA0000C313.pdf; Height: 0.7mm; Manufacturer_Part_Number: ERJ-1TRQFR68U; Mouser Part Number: 667-ERJ-1TRQFR68U; Mouser Price/Stock: https://www.mouser.co.uk/ProductDetail/Panasonic/ERJ-1TRQFR68U?qs=KH2o3k57USgNjqoTZI41Yg%3D%3D; Arrow Part Number: ERJ-1TRQFR68U; Arrow Price/Stock: http://www.arrow.com/en/products/erj-1trqfr68u/panasonic
U1 = MCP1501T-20E_CHY: Undefined or Miscellaneous; Manufacturer_Name: Microchip; Manufacturer_Part_Number: MCP1501T-20E/CHY; Datasheet Link: http://ww1.microchip.com/downloads/en/DeviceDoc/20005474E.pdf; Height: 1.45mm; Mouser Part Number: 579-MCP1501T-20E/CHY; Mouser Price/Stock: https://www.mouser.co.uk/ProductDetail/Microchip-Technology/MCP1501T-20E-CHY?qs=8cKuZ6Ok2laZOTxy%252BagHYQ%3D%3D; Arrow Part Number: MCP1501T-20E/CHY; Arrow Price/Stock: https://www.arrow.com/en/products/mcp1501t-20echy/microchip-technology?region=nac
U2 = DCX114EU-7-F: Transistor; Manufacturer_Name: Diodes Incorporated; Datasheet Link: https://www.diodes.com//assets/Datasheets/DCX_XXXX_U.pdf; Height: 1.1mm; Manufacturer_Part_Number: DCX114EU-7-F; Mouser Part Number: 621-DCX114EU-F; Mouser Price/Stock: https://www.mouser.co.uk/ProductDetail/Diodes-Incorporated/DCX114EU-7-F?qs=FWY5TENB76K1Fe%2F9QqOVGw%3D%3D; Arrow Part Number: DCX114EU-7-F; Arrow Price/Stock: https://www.arrow.com/en/products/dcx114eu-7-f/diodes-incorporated?region=nac
U3 = NSBC114EPDXV6T1G: Transistor; Manufacturer_Name: onsemi; Datasheet Link: https://www.onsemi.com/pub/Collateral/DTC114EP-D.PDF; Height: 0.6mm; Manufacturer_Part_Number: NSBC114EPDXV6T1G; Mouser Part Number: 863-NSBC114EPDXV6T1G; Mouser Price/Stock: https://www.mouser.co.uk/ProductDetail/onsemi/NSBC114EPDXV6T1G?qs=ZXBb0xZ9WeA8U8vrzPHhpw%3D%3D; Arrow Part Number: NSBC114EPDXV6T1G; Arrow Price/Stock: https://www.arrow.com/en/products/nsbc114epdxv6t1g/on-semiconductor
U4 = MCP1799T-5002H_TT: Integrated Circuit; Manufacturer_Name: Microchip; Manufacturer_Part_Number: MCP1799T-5002H/TT; Datasheet Link: https://eu.mouser.com/datasheet/2/268/MCP1799-Data-Sheet-20006248A-1658571.pdf; Height: 1.12mm; Mouser Part Number: 579-CP1799T-5002H/TT; Mouser Price/Stock: https://www.mouser.co.uk/ProductDetail/Microchip-Technology/MCP1799T-5002H-TT?qs=BJlw7L4Cy7%2Fnzou%252BAWMPCQ%3D%3D; Arrow Part Number: MCP1799T-5002H/TT; Arrow Price/Stock: https://www.arrow.com/en/products/mcp1799t-5002htt/microchip-technology?region=nac
U5 = BAV99WT1G: Diode; Manufacturer_Name: onsemi; Datasheet Link: https://www.onsemi.com/pub/Collateral/BAV99WT1-D.PDF; Height: 1mm; Manufacturer_Part_Number: BAV99WT1G; Mouser Part Number: 863-BAV99WT1G; Mouser Price/Stock: https://www.mouser.co.uk/ProductDetail/onsemi/BAV99WT1G?qs=vLkC5FC1VN9SjWG14gepYQ%3D%3D; Arrow Part Number: BAV99WT1G; Arrow Price/Stock: https://www.arrow.com/en/products/bav99wt1g/on-semiconductor?region=europe
U6 = DTC143ZMT2L: Integrated Circuit; Manufacturer_Name: ROHM Semiconductor; Datasheet Link: https://componentsearchengine.com/Datasheets/2/DTC143ZMT2L.pdf; Height: 0.55mm; Manufacturer_Part_Number: DTC143ZMT2L; Mouser Part Number: 755-DTC143ZMT2L; Mouser Price/Stock: https://www.mouser.co.uk/ProductDetail/ROHM-Semiconductor/DTC143ZMT2L?qs=4kLU8WoGk0vYvE9YcoCW%2Fw%3D%3D; Arrow Part Number: DTC143ZMT2L; Arrow Price/Stock: https://www.arrow.com/en/products/dtc143zmt2l/rohm-semiconductor
U7 = LP2998MA_NOPB: Integrated Circuit; Manufacturer_Name: Texas Instruments; Manufacturer_Part_Number: LP2998MA/NOPB; Datasheet Link: http://www.ti.com/lit/ds/symlink/lp2998.pdf; Height: 1.75mm; Mouser Part Number: 926-LP2998MA/NOPB; Mouser Price/Stock: https://www.mouser.co.uk/ProductDetail/Texas-Instruments/LP2998MA-NOPB?qs=1FNqv8aZn1TaSlCYzX0F8g%3D%3D; Arrow Part Number: LP2998MA/NOPB; Arrow Price/Stock: https://www.arrow.com/en/products/lp2998manopb/texas-instruments?region=nac
U8 = LT1184CS#PBF: Integrated Circuit; Manufacturer_Name: Analog Devices; Datasheet Link: https://www.analog.com/LT1184/datasheet; Height: 1.752mm; Manufacturer_Part_Number: LT1184CS#PBF; Mouser Part Number: 584-LT1184CS#PBF; Mouser Price/Stock: https://www.mouser.co.uk/ProductDetail/Analog-Devices/LT1184CSPBF?qs=ytflclh7QUX%2F8pNs5%2FDriw%3D%3D; Arrow Part Number: LT1184CS#PBF; Arrow Price/Stock: https://www.arrow.com/en/products/lt1184cspbf/analog-devices?region=nac
U9 = XMC1404F064X0200AAXUMA1: Integrated Circuit; Manufacturer_Name: Infineon; Datasheet Link: https://www.infineon.com/dgdl/Infineon-XMC1400-DS-v01_03-EN.pdf?fileId=5546d46250cc1fdf015110a2596343b2; Height: 1.6mm; Manufacturer_Part_Number: XMC1404F064X0200AAXUMA1; Mouser Part Number: 726-1404F064X0200AAX; Mouser Price/Stock: https://www.mouser.co.uk/ProductDetail/Infineon-Technologies/XMC1404F064X0200AAXUMA1?qs=RJIhqtkBntMgBBT277ER3w%3D%3D; Arrow Part Number: XMC1404F064X0200AAXUMA1; Arrow Price/Stock: https://www.arrow.com/en/products/xmc1404f064x0200aaxuma1/cypress-semiconductor?region=nac
U10 = CMP-0270-00194-1: EFM32 Tiny Gecko, M3 ARM Cortex CPU, 32 KB Flash, 4 KB RAM, 1.85 - 3.8 V Supply, 32 MHz Max Speed, -40 to 85 degC, 48-Pin TQFP, RoHS Compliant; AES: Y; Max Speed (MHz): 32; RAM (KB): 4; OPAMPS: 3; GPIO: 37; ComponentLink3Description: Package Specification; ComponentLink1URL: http://www.energymicro.com/; ComponentLink2URL: http://cdn.energymicro.com/dl/devices/pdf/d0051_efm32tg222_datasheet.pdf; Subcategory: EFM32 Tiny Gecko; PartNumber: EFM32TG222F32-QFP48; Mounting Technology: Surface Mount; Generic Part Number: EFM32TG222; DatasheetVersion: Rev 1.00; ComponentLink3URL: http://cdn.energymicro.com/dl/devices/pdf/d0033_efm32g222_datasheet.pdf; ADC: Y; LESENSE: Y; Supply Voltage (V): 1.85 - 3.8; PackageVersion: Rev. 98SPP48097A_XO_30Mar11; PackageReference: TQFP48; ARM Cortex CPU: M3; PackageDescription: 48-Pin Quad Flat Package, Body 7 x 7 mm, Pitch 0.5 mm; ComponentLink2Description: Datasheet; ComponentLink1Description: Manufacturer URL; Flash (KB): 32
U11 = CMP-00252-24995440-1: USB3250-ABZJ IC Usb 2.0 Phy Utmi 56QFN / Phy 1-CH 12MBPS/480MBPS 1.8V/3.3V 56-PIN QFN Tray; ESD Protection: Yes; Operating Supply Current: 460mA; USB Standard: USB 2.0; Number of Channels: 1; Max Supply Voltage: 3.6V; Operating Supply Voltage: 3.3V; Min Supply Voltage: 1.6V; Ambient Temperature Range High: 85°C; Case/Package: QFN; NexarPartId: 24995440; Length: 8.15mm; Height: 950µm; Lifecycle Status: Production; Number of Transceivers: 1; Data Rate: 480Mbps; Lead Free: Lead Free; Number of Pins: 56; Min Operating Temperature: -40°C; Nominal Supply Current: 460mA; Packaging: Cut Tape; REACH SVHC: No SVHC; Number of Ports: 1; Schedule B: 8542310000, 8542310000; Radiation Hardening: No; Width: 8.15mm; Max Operating Temperature: 85°C; Interface: USB; Weight: 191.387631mg; RoHS: Compliant; Mount: Surface Mount
U12 = CMP-0551-00052-2: Multi-Standard Power Management Unit with 1 Buck DCDC, 5 RF LDOs, 2 Digital LDOs, QFN-48, Pb-Free, Reel; Manufacturer: AMS; Audio DAC: FALSE; DC-DC Step up: 45mA (Backlight); Digital LDOs: 2x250mA; DC-DC Step down: 500 mA; Audio Features: 0.5W Stereo; Curr. Sinks: 4x160mA; Charger Startup Seq.: "LinearCustom","8x"; RF LDOs: 3x200mA, 2x150mA; Charge Pump: 5V/30mA; GP ADC: 10 Bit; PackageVersion: Rev. 1.22, 08/2009; PartNumber: AS3604B-ZQFP; Audio ADC: FALSE; PackageDescription: 48-Pin Plastic Quad Flatpack, No Leads, 6 x 6 mm Body, 0.4 mm Pitch, 4.3 x 4.3 mm Exposed Pad; Mounting Technology: Surface Mount; ComponentLink2Description: Datasheet; ComponentLink1Description: Manufacturer URL; Code_JEDEC: MO-220; ComponentLink1URL: www.ams.com; PackageReference: QFN-48; DatasheetVersion: Rev. 1.22; ComponentLink2URL: http://www.ams.com/eng/content/download/35028/492693/file/AS3604_Datasheet_v1_22.pdf
U13 = CMP-08140-000035-1: BLUE GECKO, QFN40, SECURE BOOT W; RoHS Compliant: Yes
U14 = CMP-2000-07570-1: USBXpress(TM) Family, 4 GPIOs, 2.2 to 3.6 V, -40 to 85 degC, 24-Pin QFN, RoHS; Manufacturer: Silicon Labs; Max Supply Voltage: 3.6V; Min Supply Voltage: 3V; Datasheet Version: Rev. 1.1, 08/2016; Max Operating Temperature: 85degC; Case\/Package: QFN; Number of Pins: 24; Min Operating Temperature: -40degC; Mounting Technology: SurfaceMount; Manufacturer URL: http://www.silabs.com/; RoHSCompliant: False; Package Reference: QFN-24-2550x2550TP_A; Datasheet URL: http://www.silabs.com/documents/public/data-sheets/cp2102n-datasheet.pdf; Package Description: 24-Pin Quad Flat No-lead Package, Body 4 x 4 mm, Pitch 0.5 mm; REACH SVHC: Unknown
U15 = C8051F527A-IM: Integrated Circuit; Manufacturer_Name: Silicon Labs; Datasheet Link: http://www.silabs.com/documents/public/data-sheets/C8051F52x-F53x.pdf; Height: 1mm; Manufacturer_Part_Number: C8051F527A-IM; Mouser Part Number: 634-C8051F527A-IM; Mouser Price/Stock: https://www.mouser.co.uk/ProductDetail/Silicon-Labs/C8051F527A-IM?qs=EIgIgHbwPd2ZnHOb5mQUdA%3D%3D; Arrow Part Number: C8051F527A-IM; Arrow Price/Stock: https://www.arrow.com/en/products/c8051f527a-im/silicon-labs
U16 = EFM8BB51F16I-C-QFN20R: Integrated Circuit; Manufacturer_Name: Silicon Labs; Datasheet Link: https://www.silabs.com/documents/public/data-sheets/efm8bb51-datasheet.pdf; Height: 0.8mm; Manufacturer_Part_Number: EFM8BB51F16I-C-QFN20R; Mouser Part Number: 634-EFM851F16IQFN20R; Mouser Price/Stock: https://www.mouser.co.uk/ProductDetail/Silicon-Labs/EFM8BB51F16I-C-QFN20R?qs=7D1LtPJG0i1b0vbDDJZGSQ%3D%3D
U17 = PIC12LF1822T-I_MF: Integrated Circuit; Manufacturer_Name: Microchip; Manufacturer_Part_Number: PIC12LF1822T-I/MF; Datasheet Link: https://componentsearchengine.com/Datasheets/1/PIC12LF1822T-I_MF.pdf; Height: 1mm; Mouser Part Number: 579-PIC12LF1822TI/MF; Mouser Price/Stock: https://www.mouser.co.uk/ProductDetail/Microchip-Technology/PIC12LF1822T-I-MF?qs=jecpP1bYcZQUF17R1GX6Gw%3D%3D; Arrow Part Number: PIC12LF1822T-I/MF; Arrow Price/Stock: https://www.arrow.com/en/products/pic12lf1822t-imf/microchip-technology?region=nac
U18 = CMP-00572-21273460-1: Two-wire serial interface 32k EEPROM (4-kword × 8-bit); Manufacturer Lifecycle Status: ACTIVE; Frequency: 400kHz; Access Time: 900ns; Max Input Voltage: 5.5V; Nominal Supply Current: 3mA; Min Supply Voltage: 1.8V; Interface: I2C; Density: 32kb; Number of Pins: 8; Max Operating Temperature: 85°C; ComponentLink2URL: https://octopart.com/cad-content/api/get-model-datasheet/15189/21273460; Mount: Surface Mount; Lead Free: Lead Free; HelpURL: https://octopart.com/cad-content/api/get-model-datasheet/15189/21273460; Clock Rate: 400kHz; Max Frequency: 400kHz; China RoHS: Compliant; ComponentLink3Description: Manufacturer's Package Drawing; Case/Package: SOP; Memory Type: EEPROM; Lifecycle Status: Production; Height: 1.73mm; Radiation Hardening: No; Min Operating Temperature: -40°C; ComponentLink1Description: Manufacturer's Website; Max Supply Voltage: 5.5V; ComponentLink3URL: https://www.renesas.com/en/document/psc/package-drawing-sop-8pin-prsp0008df-b; Width: 4mm; Min Input Voltage: 1.8V; ComponentLink1URL: http://www.renesas.com; ComponentLink2Description: Datasheet URL; Length: 5mm; RoHS: Compliant; Memory Size: 32kB
U19 = CMP-12111-000001-1: IC TRANSCEIVER FULL 2/2 16SO; Manufacturer: STMicroelectronics; Number Of Transmitters: 2; Standoff Height: 0.1mm; Max Supply Voltage: 5.5V; Interface: RS-232; Min Supply Voltage: 4.5V; Nominal Supply Current: 5mA; Simplex Duplex: Full Duplex; Data Rate: 220kbits/s; ComponentLink2URL: https://www.st.com/resource/en/datasheet/st232b.pdf; Mouser Description: Buffers & Line Drivers 5V 2Driver/2Receiver; ComponentLink2Description: Datasheet; Temperature: -40°C to +85°C; RoHS: TRUE; Device Class L1: Integrated Circuits (ICs); Device Class L2: Interface ICs; Height: 1.75mm; Number Of Receivers: 2; Digikey Description: IC TRANSCEIVER FULL 2/2 16SO; Lead Free: Yes; Temperature Range High: +85°C; Automotive: No; Octopart: https://octopart.com/st232bdr-stmicroelectronics-503622; Device Class L3: RS-232 / RS-422 / RS-485 Interface ICs; Package: SO-16-0016020D; Temperature Range Low: -40°C; Manufacturer Part Number: ST232BDR; Category: IC
U20 = SN75454BPE4: Integrated Circuit; Manufacturer_Name: Texas Instruments; Datasheet Link: https://www.ti.com/lit/ds/symlink/sn75454b.pdf?ts=1635139645746&ref_url=https%253A%252F%252Fwww.ti.com%252Fstore%252Fti%252Fen%252Fp%252Fproduct%252F%253Fp%253DSN75454BP; Height: 5.08mm; Manufacturer_Part_Number: SN75454BPE4; Mouser Part Number: 595-SN75454BPE4; Mouser Price/Stock: https://www.mouser.co.uk/ProductDetail/Texas-Instruments/SN75454BPE4?qs=o4busQjUnQbHTybAhIH7OQ%3D%3D